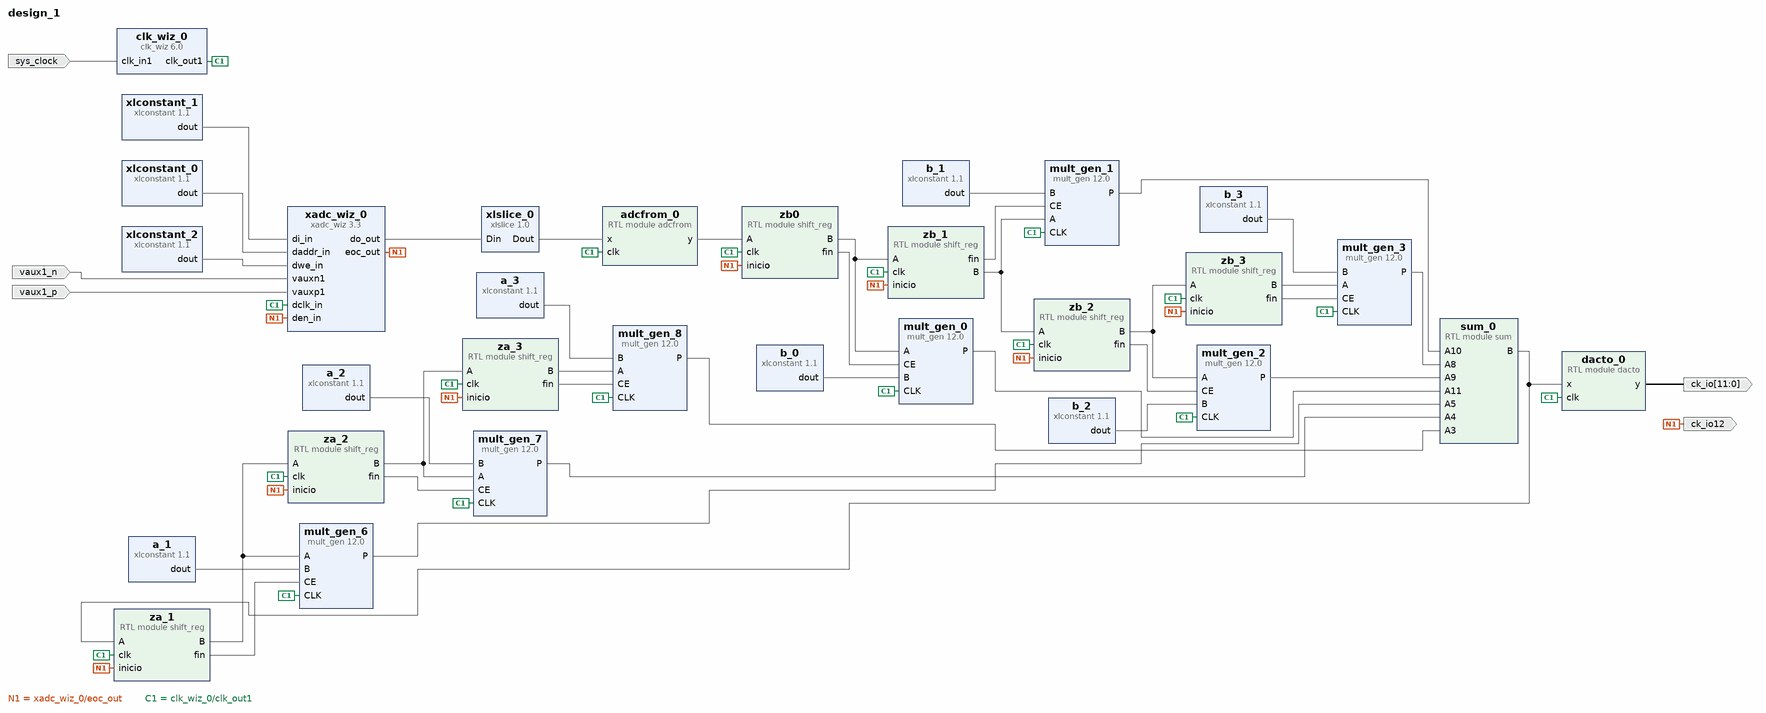
[diagram p0: block diagram of the top level]
# Vivado block design design_1, xc7z020clg400-1, Vivado 2019.1
create_bd_design design_1

create_bd_port -dir I -type clk sys_clock
set_property -dict {CONFIG.FREQ_HZ 125000000 CONFIG.PHASE 0.000} [get_bd_ports sys_clock]
create_bd_port -dir O -from 11 -to 0 -type data ck_io
create_bd_port -dir I -type data vaux1_n
create_bd_port -dir I -type data vaux1_p
create_bd_port -dir O -type data ck_io12

create_bd_cell -type ip -vlnv xilinx.com:ip:xlconstant:1.1 xlconstant_0
set_property -dict {CONFIG.CONST_VAL 0x11 CONFIG.CONST_WIDTH 7} [get_bd_cells xlconstant_0]
create_bd_cell -type ip -vlnv xilinx.com:ip:clk_wiz:6.0 clk_wiz_0
set_property -dict [list \
  CONFIG.CLKOUT2_JITTER 124.615 \
  CONFIG.CLKOUT2_PHASE_ERROR 96.948 \
  CONFIG.CLKOUT2_USED false \
  CONFIG.CLK_IN1_BOARD_INTERFACE sys_clock \
  CONFIG.MMCM_CLKOUT1_DIVIDE 1 \
  CONFIG.NUM_OUT_CLKS 1 \
  CONFIG.USE_BOARD_FLOW true \
  CONFIG.USE_LOCKED false \
  CONFIG.USE_RESET false \
] [get_bd_cells clk_wiz_0]
create_bd_cell -type ip -vlnv xilinx.com:ip:xlconstant:1.1 xlconstant_2
set_property -dict {CONFIG.CONST_VAL 0 CONFIG.CONST_WIDTH 1} [get_bd_cells xlconstant_2]
create_bd_cell -type ip -vlnv xilinx.com:ip:xlconstant:1.1 xlconstant_1
set_property -dict {CONFIG.CONST_VAL 0 CONFIG.CONST_WIDTH 16} [get_bd_cells xlconstant_1]
create_bd_cell -type ip -vlnv xilinx.com:ip:xadc_wiz:3.3 xadc_wiz_0
set_property -dict [list \
  CONFIG.ADC_OFFSET_AND_GAIN_CALIBRATION false \
  CONFIG.ENABLE_CALIBRATION_AVERAGING false \
  CONFIG.ENABLE_RESET false \
  CONFIG.ENABLE_VCCDDRO_ALARM false \
  CONFIG.ENABLE_VCCPAUX_ALARM false \
  CONFIG.ENABLE_VCCPINT_ALARM false \
  CONFIG.INTERFACE_SELECTION ENABLE_DRP \
  CONFIG.OT_ALARM false \
  CONFIG.SENSOR_OFFSET_AND_GAIN_CALIBRATION false \
  CONFIG.SINGLE_CHANNEL_ENABLE_CALIBRATION true \
  CONFIG.SINGLE_CHANNEL_SELECTION VAUXP1_VAUXN1 \
  CONFIG.USER_TEMP_ALARM false \
  CONFIG.VCCAUX_ALARM false \
  CONFIG.VCCINT_ALARM false \
] [get_bd_cells xadc_wiz_0]
create_bd_cell -type ip -vlnv xilinx.com:ip:xlslice:1.0 xlslice_0
set_property -dict {CONFIG.DIN_FROM 15 CONFIG.DIN_TO 4 CONFIG.DIN_WIDTH 16 CONFIG.DOUT_WIDTH 11} [get_bd_cells xlslice_0]
create_bd_cell -type ip -vlnv xilinx.com:ip:mult_gen:12.0 mult_gen_0
set_property -dict [list \
  CONFIG.ClockEnable true \
  CONFIG.MultType Parallel_Multiplier \
  CONFIG.OutputWidthHigh 95 \
  CONFIG.OutputWidthLow 32 \
  CONFIG.PipeStages 1 \
  CONFIG.PortAWidth 64 \
  CONFIG.PortBWidth 64 \
  CONFIG.SyncClear false \
  CONFIG.Use_Custom_Output_Width true \
] [get_bd_cells mult_gen_0]
create_bd_cell -type ip -vlnv xilinx.com:ip:xlconstant:1.1 b_0
set_property -dict {CONFIG.CONST_VAL 0x000000000077C7B3 CONFIG.CONST_WIDTH 64} [get_bd_cells b_0]
create_bd_cell -type module -reference adcfrom adcfrom_0
create_bd_cell -type ip -vlnv xilinx.com:ip:mult_gen:12.0 mult_gen_1
set_property -dict [list \
  CONFIG.ClockEnable true \
  CONFIG.MultType Parallel_Multiplier \
  CONFIG.OutputWidthHigh 95 \
  CONFIG.OutputWidthLow 32 \
  CONFIG.PipeStages 1 \
  CONFIG.PortAWidth 64 \
  CONFIG.PortBWidth 64 \
  CONFIG.SyncClear false \
  CONFIG.Use_Custom_Output_Width true \
] [get_bd_cells mult_gen_1]
create_bd_cell -type ip -vlnv xilinx.com:ip:xlconstant:1.1 b_1
set_property -dict {CONFIG.CONST_VAL 0x0000000001675719 CONFIG.CONST_WIDTH 64} [get_bd_cells b_1]
create_bd_cell -type module -reference dacto dacto_0
create_bd_cell -type ip -vlnv xilinx.com:ip:mult_gen:12.0 mult_gen_2
set_property -dict [list \
  CONFIG.ClockEnable true \
  CONFIG.MultType Parallel_Multiplier \
  CONFIG.OutputWidthHigh 95 \
  CONFIG.OutputWidthLow 32 \
  CONFIG.PipeStages 1 \
  CONFIG.PortAWidth 64 \
  CONFIG.PortBWidth 64 \
  CONFIG.SyncClear false \
  CONFIG.Use_Custom_Output_Width true \
] [get_bd_cells mult_gen_2]
create_bd_cell -type ip -vlnv xilinx.com:ip:mult_gen:12.0 mult_gen_3
set_property -dict [list \
  CONFIG.ClockEnable true \
  CONFIG.MultType Parallel_Multiplier \
  CONFIG.OutputWidthHigh 95 \
  CONFIG.OutputWidthLow 32 \
  CONFIG.PipeStages 1 \
  CONFIG.PortAWidth 64 \
  CONFIG.PortBWidth 64 \
  CONFIG.SyncClear false \
  CONFIG.Use_Custom_Output_Width true \
] [get_bd_cells mult_gen_3]
create_bd_cell -type ip -vlnv xilinx.com:ip:xlconstant:1.1 b_2
set_property -dict {CONFIG.CONST_VAL 0x0000000001675719 CONFIG.CONST_WIDTH 64} [get_bd_cells b_2]
create_bd_cell -type ip -vlnv xilinx.com:ip:xlconstant:1.1 b_3
set_property -dict {CONFIG.CONST_VAL 0x000000000077C7B3 CONFIG.CONST_WIDTH 64} [get_bd_cells b_3]
create_bd_cell -type ip -vlnv xilinx.com:ip:mult_gen:12.0 mult_gen_6
set_property -dict [list \
  CONFIG.ClockEnable true \
  CONFIG.MultType Parallel_Multiplier \
  CONFIG.OutputWidthHigh 95 \
  CONFIG.OutputWidthLow 32 \
  CONFIG.PipeStages 1 \
  CONFIG.PortAWidth 64 \
  CONFIG.PortBWidth 64 \
  CONFIG.SyncClear false \
  CONFIG.Use_Custom_Output_Width true \
] [get_bd_cells mult_gen_6]
create_bd_cell -type ip -vlnv xilinx.com:ip:mult_gen:12.0 mult_gen_7
set_property -dict [list \
  CONFIG.ClockEnable true \
  CONFIG.MultType Parallel_Multiplier \
  CONFIG.OutputWidthHigh 95 \
  CONFIG.OutputWidthLow 32 \
  CONFIG.PipeStages 1 \
  CONFIG.PortAWidth 64 \
  CONFIG.PortBWidth 64 \
  CONFIG.SyncClear false \
  CONFIG.Use_Custom_Output_Width true \
] [get_bd_cells mult_gen_7]
create_bd_cell -type ip -vlnv xilinx.com:ip:mult_gen:12.0 mult_gen_8
set_property -dict [list \
  CONFIG.ClockEnable true \
  CONFIG.MultType Parallel_Multiplier \
  CONFIG.OutputWidthHigh 95 \
  CONFIG.OutputWidthLow 32 \
  CONFIG.PipeStages 1 \
  CONFIG.PortAWidth 64 \
  CONFIG.PortBWidth 64 \
  CONFIG.SyncClear false \
  CONFIG.Use_Custom_Output_Width true \
] [get_bd_cells mult_gen_8]
create_bd_cell -type ip -vlnv xilinx.com:ip:xlconstant:1.1 a_1
set_property -dict {CONFIG.CONST_VAL 0x00000002785B8840 CONFIG.CONST_WIDTH 64} [get_bd_cells a_1]
create_bd_cell -type ip -vlnv xilinx.com:ip:xlconstant:1.1 a_2
set_property -dict {CONFIG.CONST_VAL 0xFFFFFFFDEDA83EAA CONFIG.CONST_WIDTH 64} [get_bd_cells a_2]
create_bd_cell -type ip -vlnv xilinx.com:ip:xlconstant:1.1 a_3
set_property -dict {CONFIG.CONST_VAL 0x00000000963DFB80 CONFIG.CONST_WIDTH 64} [get_bd_cells a_3]
create_bd_cell -type module -reference shift_reg zb_1
create_bd_cell -type module -reference shift_reg zb_2
create_bd_cell -type module -reference shift_reg zb_3
create_bd_cell -type module -reference sum sum_0
create_bd_cell -type module -reference shift_reg za_2
create_bd_cell -type module -reference shift_reg za_3
create_bd_cell -type module -reference shift_reg za_1
create_bd_cell -type module -reference shift_reg zb0

# ---- connections ----

connect_bd_net [get_bd_ports sys_clock] [get_bd_pins clk_wiz_0/clk_in1]
connect_bd_net [get_bd_pins xlconstant_1/dout] [get_bd_pins xadc_wiz_0/di_in]
connect_bd_net [get_bd_pins xlconstant_0/dout] [get_bd_pins xadc_wiz_0/daddr_in]
connect_bd_net [get_bd_pins xadc_wiz_0/do_out] [get_bd_pins xlslice_0/Din]
connect_bd_net [get_bd_pins xlconstant_2/dout] [get_bd_pins xadc_wiz_0/dwe_in]
connect_bd_net [get_bd_ports vaux1_n] [get_bd_pins xadc_wiz_0/vauxn1]
connect_bd_net [get_bd_ports vaux1_p] [get_bd_pins xadc_wiz_0/vauxp1]
connect_bd_net -net xlconstant_3_dout [get_bd_pins b_0/dout] [get_bd_pins mult_gen_0/B]
connect_bd_net -net xlconstant_4_dout [get_bd_pins b_1/dout] [get_bd_pins mult_gen_1/B]
connect_bd_net -net shift_reg_0_out [get_bd_pins zb_1/B] [get_bd_pins mult_gen_1/A] [get_bd_pins zb_2/A]
connect_bd_net -net shift_reg_1_B [get_bd_pins zb_2/B] [get_bd_pins mult_gen_2/A] [get_bd_pins zb_3/A]
connect_bd_net -net xlconstant_5_dout [get_bd_pins b_2/dout] [get_bd_pins mult_gen_2/B]
connect_bd_net -net shift_reg_2_B [get_bd_pins zb_3/B] [get_bd_pins mult_gen_3/A]
connect_bd_net -net xlconstant_6_dout [get_bd_pins b_3/dout] [get_bd_pins mult_gen_3/B]
connect_bd_net -net shift_reg_5_B [get_bd_pins za_1/B] [get_bd_pins mult_gen_6/A] [get_bd_pins za_2/A]
connect_bd_net -net xlconstant_9_dout [get_bd_pins a_1/dout] [get_bd_pins mult_gen_6/B]
connect_bd_net -net shift_reg_6_B [get_bd_pins za_2/B] [get_bd_pins mult_gen_7/A] [get_bd_pins za_3/A]
connect_bd_net -net xlconstant_10_dout [get_bd_pins a_2/dout] [get_bd_pins mult_gen_7/B]
connect_bd_net -net shift_reg_7_B [get_bd_pins za_3/B] [get_bd_pins mult_gen_8/A]
connect_bd_net -net xlconstant_11_dout [get_bd_pins a_3/dout] [get_bd_pins mult_gen_8/B]
connect_bd_net [get_bd_pins sum_0/B] [get_bd_pins dacto_0/x] [get_bd_pins za_1/A]
connect_bd_net [get_bd_pins mult_gen_0/P] [get_bd_pins sum_0/A11]
connect_bd_net [get_bd_pins mult_gen_1/P] [get_bd_pins sum_0/A10]
connect_bd_net [get_bd_pins mult_gen_2/P] [get_bd_pins sum_0/A9]
connect_bd_net [get_bd_pins mult_gen_3/P] [get_bd_pins sum_0/A8]
connect_bd_net [get_bd_pins mult_gen_6/P] [get_bd_pins sum_0/A5]
connect_bd_net [get_bd_pins mult_gen_7/P] [get_bd_pins sum_0/A4]
connect_bd_net [get_bd_pins mult_gen_8/P] [get_bd_pins sum_0/A3]
connect_bd_net [get_bd_pins dacto_0/y] [get_bd_ports ck_io]
connect_bd_net [get_bd_pins xlslice_0/Dout] [get_bd_pins adcfrom_0/x]
connect_bd_net [get_bd_pins xadc_wiz_0/eoc_out] \
  [get_bd_pins xadc_wiz_0/den_in] [get_bd_ports ck_io12] [get_bd_pins zb_1/inicio] [get_bd_pins zb_2/inicio] \
  [get_bd_pins zb_3/inicio] [get_bd_pins za_2/inicio] [get_bd_pins za_3/inicio] [get_bd_pins za_1/inicio] \
  [get_bd_pins zb0/inicio]
connect_bd_net [get_bd_pins clk_wiz_0/clk_out1] \
  [get_bd_pins xadc_wiz_0/dclk_in] [get_bd_pins adcfrom_0/clk] [get_bd_pins mult_gen_0/CLK] [get_bd_pins mult_gen_1/CLK] \
  [get_bd_pins mult_gen_2/CLK] [get_bd_pins mult_gen_3/CLK] [get_bd_pins dacto_0/clk] [get_bd_pins mult_gen_7/CLK] \
  [get_bd_pins mult_gen_8/CLK] [get_bd_pins mult_gen_6/CLK] [get_bd_pins zb_1/clk] [get_bd_pins zb_2/clk] \
  [get_bd_pins zb_3/clk] [get_bd_pins za_2/clk] [get_bd_pins za_3/clk] [get_bd_pins za_1/clk] [get_bd_pins zb0/clk]
connect_bd_net -net zb_4_B [get_bd_pins zb0/B] [get_bd_pins mult_gen_0/A] [get_bd_pins zb_1/A]
connect_bd_net [get_bd_pins adcfrom_0/y] [get_bd_pins zb0/A]
connect_bd_net [get_bd_pins zb0/fin] [get_bd_pins mult_gen_0/CE]
connect_bd_net [get_bd_pins zb_1/fin] [get_bd_pins mult_gen_1/CE]
connect_bd_net [get_bd_pins zb_2/fin] [get_bd_pins mult_gen_2/CE]
connect_bd_net [get_bd_pins zb_3/fin] [get_bd_pins mult_gen_3/CE]
connect_bd_net [get_bd_pins za_1/fin] [get_bd_pins mult_gen_6/CE]
connect_bd_net [get_bd_pins za_2/fin] [get_bd_pins mult_gen_7/CE]
connect_bd_net [get_bd_pins za_3/fin] [get_bd_pins mult_gen_8/CE]

validate_bd_design
save_bd_design
